# EAGLE schematic moire_v2.7 (EAGLE 9.1.1)

## Sheet 1 of 2
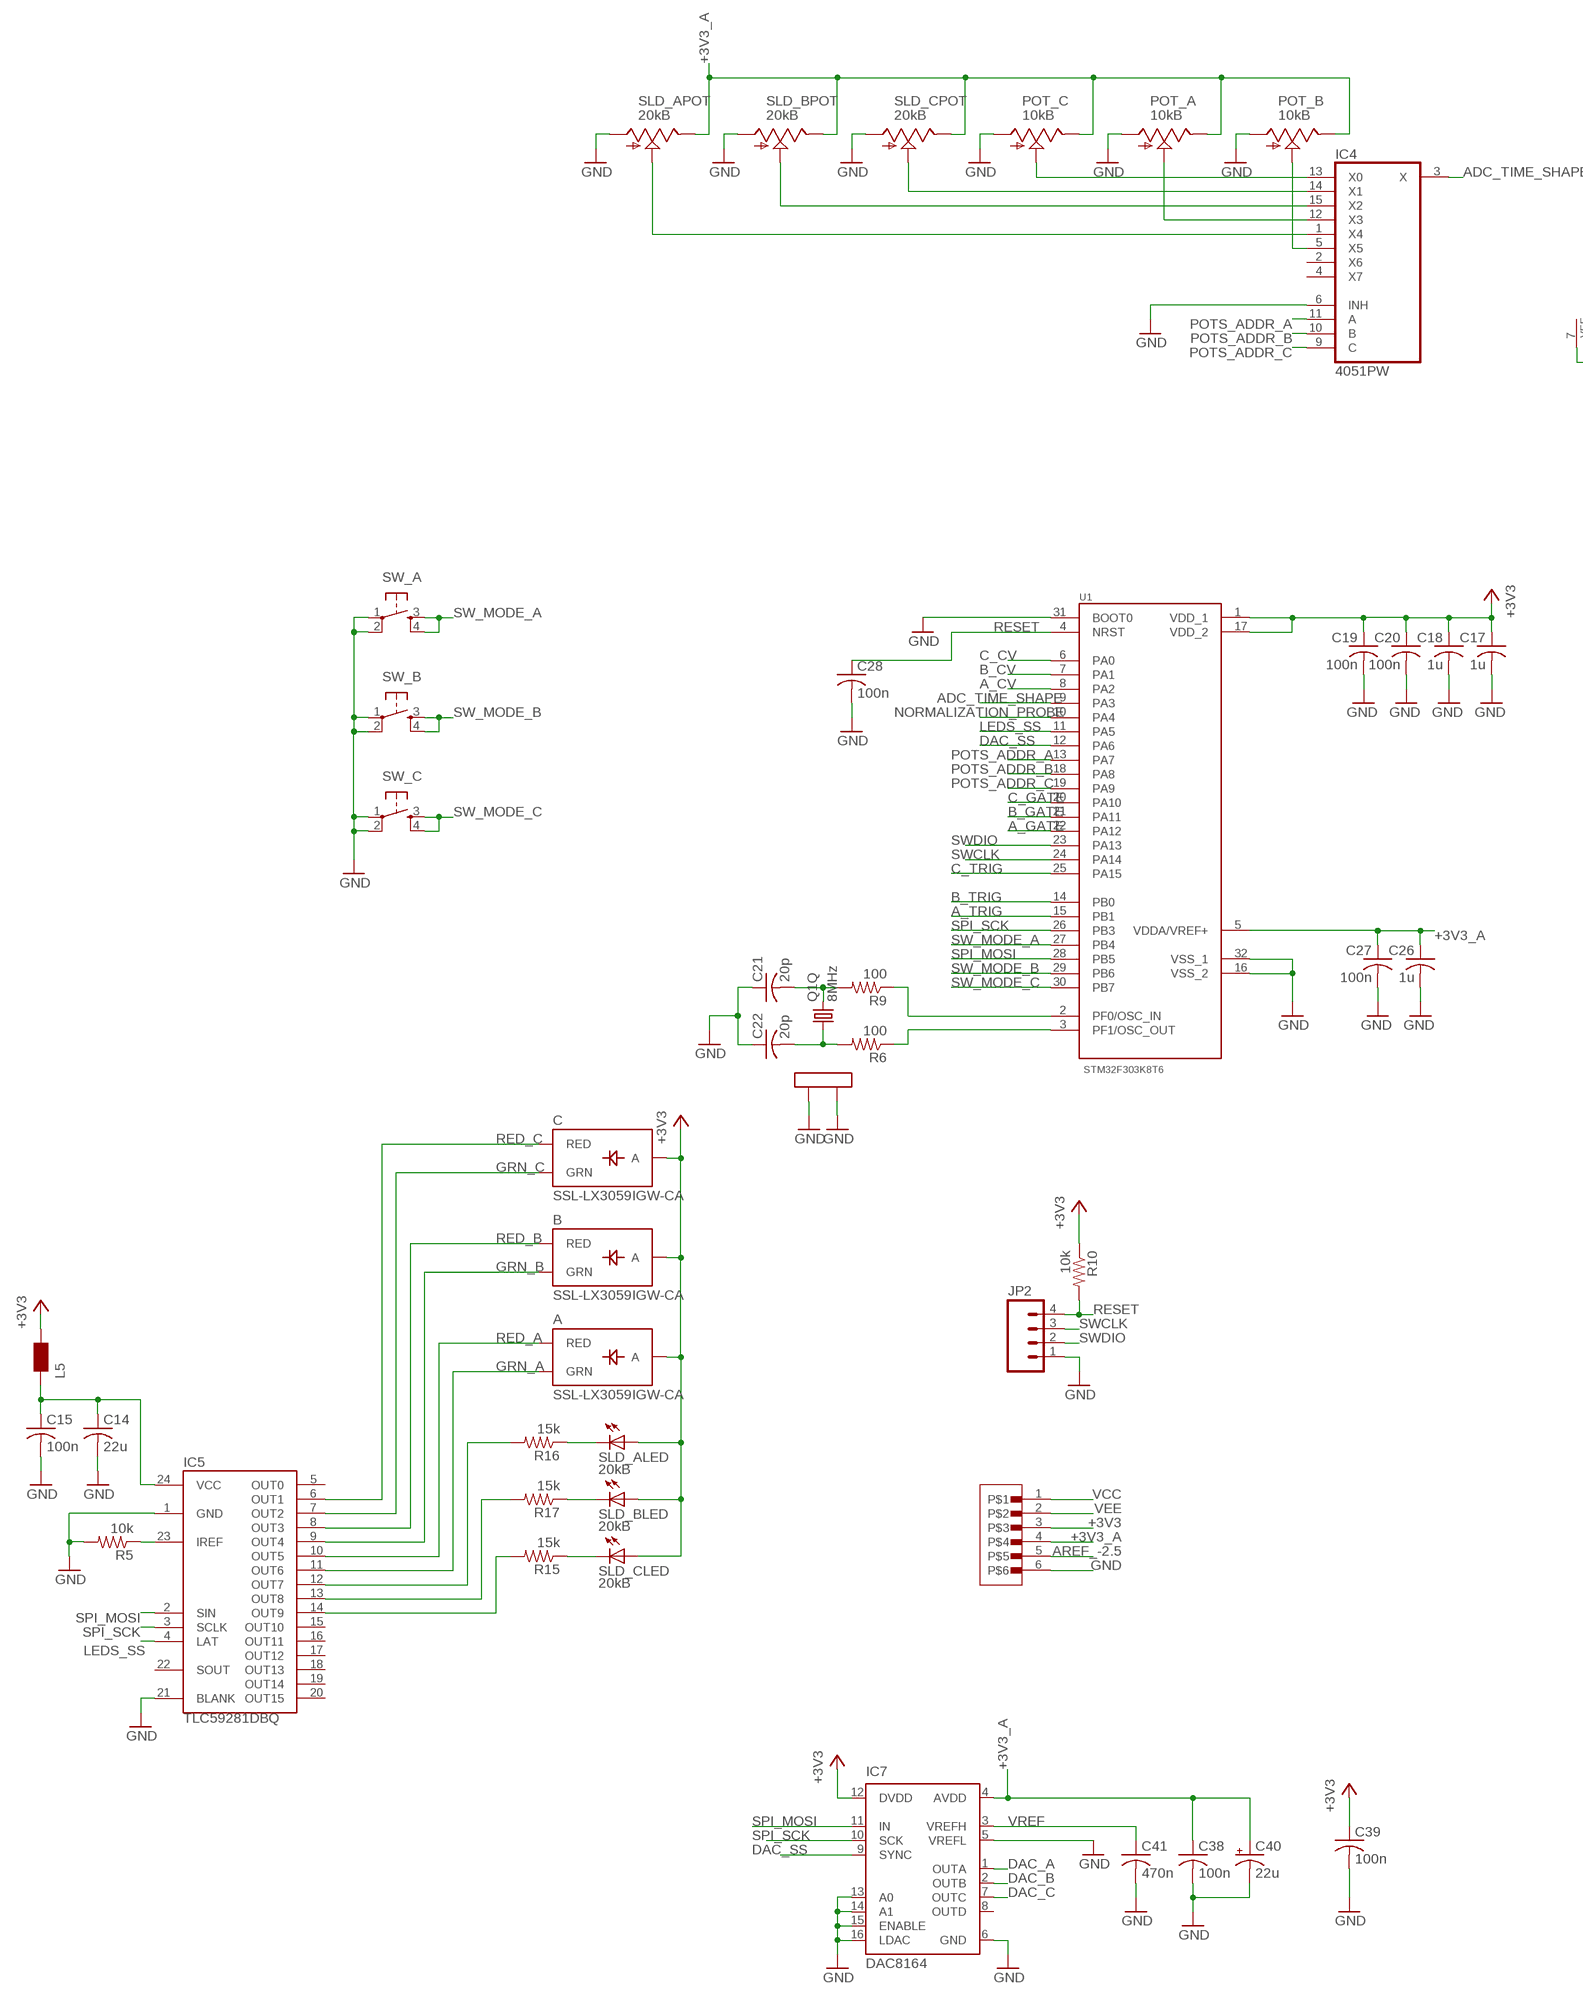
[diagram p0: schematic, sheet 1, part 1 of 2]
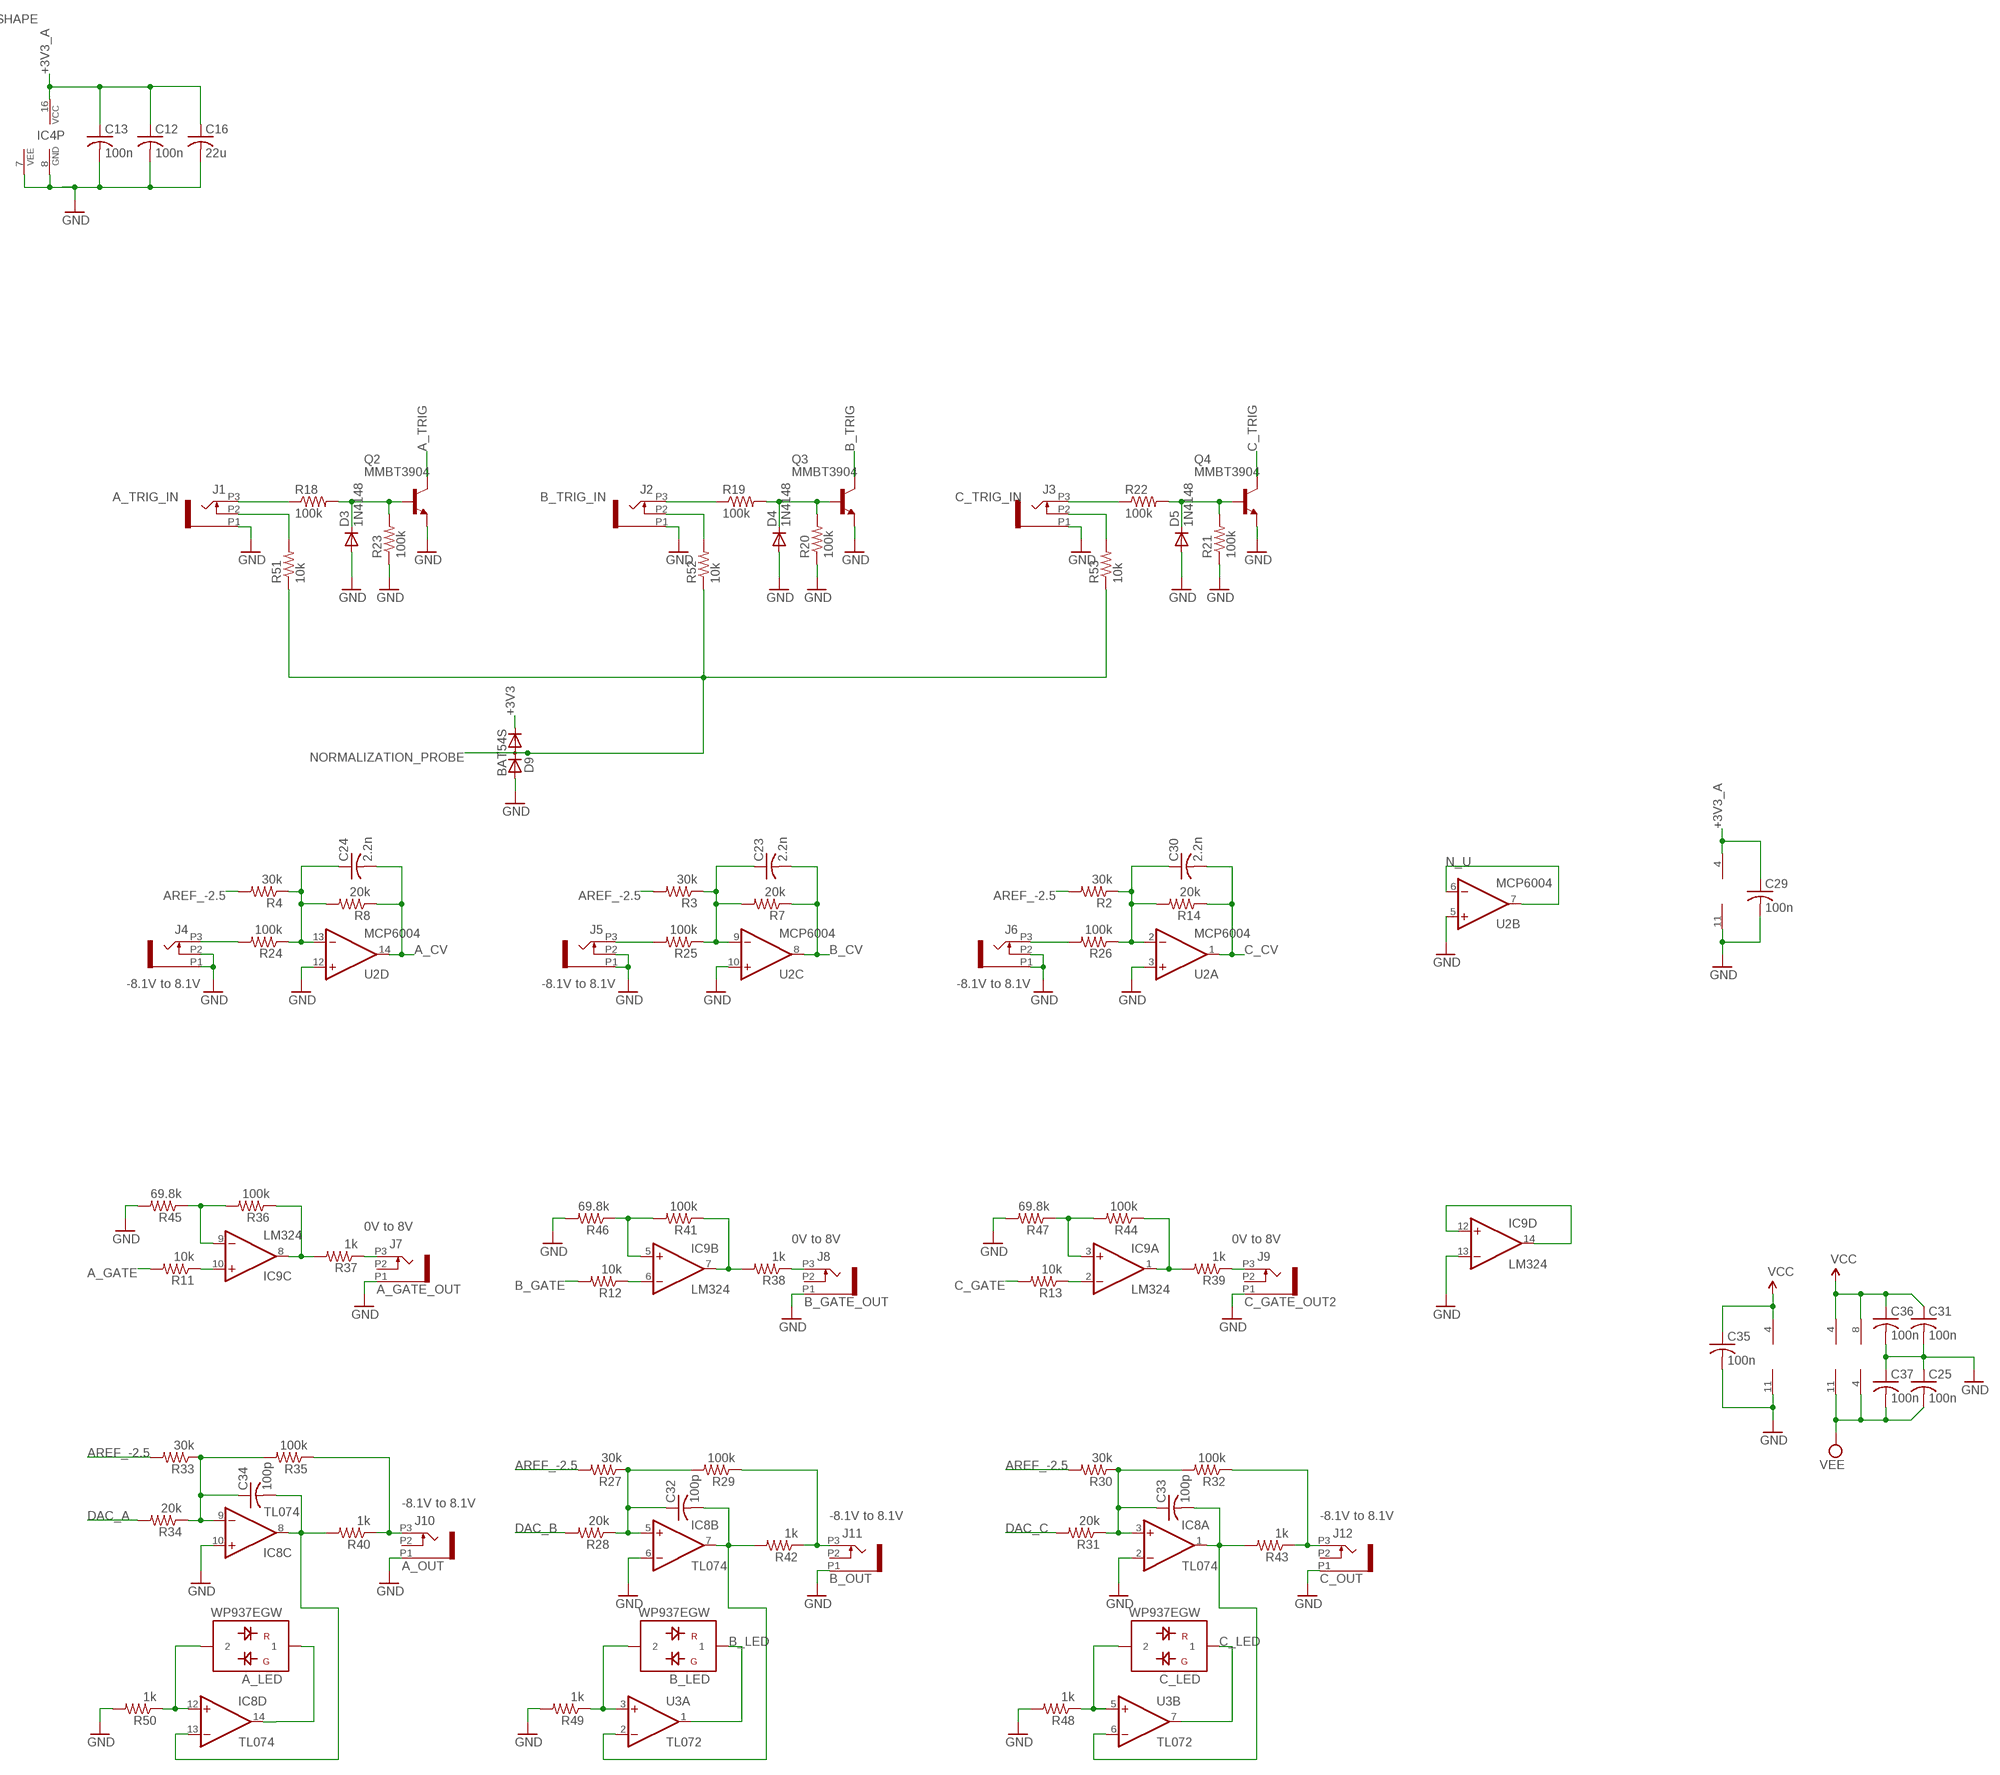
[diagram p1: schematic, sheet 1, part 2 of 2]

### Parts
A  SSL-LX3059IGW-CA  LED-BICOLOR-THROUGHHOLE-CA  [LED-BICOLOR-THROUGHHOLE-LUMEX]
A_LED  WP937EGW  LED-BICOLOR-SHARED-THROUGHHOLE  [LED3MM]
B  SSL-LX3059IGW-CA  LED-BICOLOR-THROUGHHOLE-CA  [LED-BICOLOR-THROUGHHOLE-LUMEX]
B_LED  WP937EGW  LED-BICOLOR-SHARED-THROUGHHOLE  [LED3MM]
C  SSL-LX3059IGW-CA  LED-BICOLOR-THROUGHHOLE-CA  [LED-BICOLOR-THROUGHHOLE-LUMEX]
C12  100n  RCL_C-USC0603  [RCL_C0603]
C13  100n  RCL_C-USC0603  [RCL_C0603]
C14  22u  RCL_C-USC1206  [RCL_C1206]
C15  100n  RCL_C-USC0603  [RCL_C0603]
C16  22u  RCL_C-USC1206  [RCL_C1206]
C17  1u  RCL_C-USC0603  [RCL_C0603]
C18  1u  RCL_C-USC0603  [RCL_C0603]
C19  100n  RCL_C-USC0603  [RCL_C0603]
C20  100n  RCL_C-USC0603  [RCL_C0603]
C21  20p  RCL_C-USC0603  [RCL_C0603]
C22  20p  RCL_C-USC0603  [RCL_C0603]
C23  2.2n  RCL_C-USC0603  [RCL_C0603]
C24  2.2n  RCL_C-USC0603  [RCL_C0603]
C25  100n  RCL_C-USC0603  [RCL_C0603]
C26  1u  RCL_C-USC0603  [RCL_C0603]
C27  100n  RCL_C-USC0603  [RCL_C0603]
C28  100n  RCL_C-USC0603  [RCL_C0603]
C29  100n  RCL_C-USC0603  [RCL_C0603]
C30  2.2n  RCL_C-USC0603  [RCL_C0603]
C31  100n  RCL_C-USC0603  [RCL_C0603]
C32  100p  RCL_C-USC0603  [RCL_C0603]
C33  100p  RCL_C-USC0603  [RCL_C0603]
C34  100p  RCL_C-USC0603  [RCL_C0603]
C35  100n  RCL_C-USC0603  [RCL_C0603]
C36  100n  RCL_C-USC0603  [RCL_C0603]
C37  100n  RCL_C-USC0603  [RCL_C0603]
C38  100n  C-USC0603  [C0603]
C39  100n  C-USC0603  [C0603]
C40  22u  CPOL-USC  [PANASONIC_C]
C41  470n  C-USC0603  [C0603]
C_LED  WP937EGW  LED-BICOLOR-SHARED-THROUGHHOLE  [LED3MM]
D3  1N4148  DIODE_DIODE-SOD323-R  [DIODE_SOD323-R]
D4  1N4148  DIODE_DIODE-SOD323-R  [DIODE_SOD323-R]
D5  1N4148  DIODE_DIODE-SOD323-R  [DIODE_SOD323-R]
D9  BAT54S  DIODE_2CACA-SOT23  [SOT23]
IC4  4051PW  [TSSOP16_065]
IC5  TLC59281DBQ  [TSSOP24_0635]
IC7  DAC8164  DAC8564  [SOP65P640X110-16N]
IC8  TL074  TL074PW  [TSSOP14_065]
IC9  LM324  TL074PW  [TSSOP14_065]
J1  PJ301_THONKICONN6  [WQP_PJ_301M6]
J2  PJ301_THONKICONN6  [WQP_PJ_301M6]
J3  PJ301_THONKICONN6  [WQP_PJ_301M6]
J4  PJ301_THONKICONN6  [WQP_PJ_301M6]
J5  PJ301_THONKICONN6  [WQP_PJ_301M6]
J6  PJ301_THONKICONN6  [WQP_PJ_301M6]
J7  PJ301_THONKICONN6  [WQP_PJ_301M6]
J8  PJ301_THONKICONN6  [WQP_PJ_301M6]
J9  PJ301_THONKICONN6  [WQP_PJ_301M6]
J10  PJ301_THONKICONN6  [WQP_PJ_301M6]
J11  PJ301_THONKICONN6  [WQP_PJ_301M6]
J12  PJ301_THONKICONN6  [WQP_PJ_301M6]
JP2  M04PTH  [1X04]
L5  WE-CBF_0603  [0603]
POT_A  10kB  POT_USVERTICAL  [ALPS_POT_VERTICAL]
POT_B  10kB  POT_USVERTICAL  [ALPS_POT_VERTICAL]
POT_C  10kB  POT_USVERTICAL  [ALPS_POT_VERTICAL]
Q1  8MHz  CRYSTAL  [CTS406]
Q2  MMBT3904  MMBT3904LT1-NPN-SOT23-BEC  [SOT23-BEC]
Q3  MMBT3904  MMBT3904LT1-NPN-SOT23-BEC  [SOT23-BEC]
Q4  MMBT3904  MMBT3904LT1-NPN-SOT23-BEC  [SOT23-BEC]
R2  30k  RCL_R-US_R0603  [RCL_R0603]
R3  30k  RCL_R-US_R0603  [RCL_R0603]
R4  30k  RCL_R-US_R0603  [RCL_R0603]
R5  10k  RCL_R-US_R0603  [RCL_R0603]
R6  100  RCL_R-US_R0603  [RCL_R0603]
R7  20k  RCL_R-US_R0603  [RCL_R0603]
R8  20k  RCL_R-US_R0603  [RCL_R0603]
R9  100  RCL_R-US_R0603  [RCL_R0603]
R10  10k  RCL_R-US_R0603  [RCL_R0603]
R11  10k  RCL_R-US_R0603  [RCL_R0603]
R12  10k  RCL_R-US_R0603  [RCL_R0603]
R13  10k  RCL_R-US_R0603  [RCL_R0603]
R14  20k  RCL_R-US_R0603  [RCL_R0603]
R15  15k  RCL_R-US_R0603  [RCL_R0603]
R16  15k  RCL_R-US_R0603  [RCL_R0603]
R17  15k  RCL_R-US_R0603  [RCL_R0603]
R18  100k  RCL_R-US_R0603  [RCL_R0603]
R19  100k  RCL_R-US_R0603  [RCL_R0603]
R20  100k  RCL_R-US_R0603  [RCL_R0603]
R21  100k  RCL_R-US_R0603  [RCL_R0603]
R22  100k  RCL_R-US_R0603  [RCL_R0603]
R23  100k  RCL_R-US_R0603  [RCL_R0603]
R24  100k  RCL_R-US_R0603  [RCL_R0603]
R25  100k  RCL_R-US_R0603  [RCL_R0603]
R26  100k  RCL_R-US_R0603  [RCL_R0603]
R27  30k  RCL_R-US_R0603  [RCL_R0603]
R28  20k  RCL_R-US_R0603  [RCL_R0603]
R29  100k  RCL_R-US_R0603  [RCL_R0603]
R30  30k  RCL_R-US_R0603  [RCL_R0603]
R31  20k  RCL_R-US_R0603  [RCL_R0603]
R32  100k  RCL_R-US_R0603  [RCL_R0603]
R33  30k  RCL_R-US_R0603  [RCL_R0603]
R34  20k  RCL_R-US_R0603  [RCL_R0603]
R35  100k  RCL_R-US_R0603  [RCL_R0603]
R36  100k  RCL_R-US_R0603  [RCL_R0603]
R37  1k  RCL_R-US_R0603  [RCL_R0603]
R38  1k  RCL_R-US_R0603  [RCL_R0603]
R39  1k  RCL_R-US_R0603  [RCL_R0603]
R40  1k  RCL_R-US_R0603  [RCL_R0603]
R41  100k  RCL_R-US_R0603  [RCL_R0603]
R42  1k  RCL_R-US_R0603  [RCL_R0603]
R43  1k  RCL_R-US_R0603  [RCL_R0603]
R44  100k  RCL_R-US_R0603  [RCL_R0603]
R45  69.8k  RCL_R-US_R0603  [RCL_R0603]
R46  69.8k  RCL_R-US_R0603  [RCL_R0603]
R47  69.8k  RCL_R-US_R0603  [RCL_R0603]
R48  1k  RCL_R-US_R0603  [RCL_R0603]
R49  1k  RCL_R-US_R0603  [RCL_R0603]
R50  1k  RCL_R-US_R0603  [RCL_R0603]
R51  10k  RCL_R-US_R0603  [RCL_R0603]
R52  10k  RCL_R-US_R0603  [RCL_R0603]
R53  10k  RCL_R-US_R0603  [RCL_R0603]
SLD_A  20kB  BOURNS_SLIDER  [BOURNS_SLIDER]
SLD_B  20kB  BOURNS_SLIDER  [BOURNS_SLIDER]
SLD_C  20kB  BOURNS_SLIDER  [BOURNS_SLIDER]
SW_A  TAC_SWITCHPTH  [TACTILE-PTH]
SW_B  TAC_SWITCHPTH  [TACTILE-PTH]
SW_C  TAC_SWITCHPTH  [TACTILE-PTH]
U1  STM32F303K8T6  [QFP80P900X900X160-32N]
U2  MCP6004  MCP6004_SMD  [SO14]
U3  TL072  TL072TSSOP  [TSSOP-8]
U$1  1X6-SMD-TESTPAD  [6X1-SMD-TESTPAD]

### Nets
+3V3 [power]: A.A B.A C17.1 C18.1 C19.1 C20.1 C39.1 C.A D9.2(C) IC7.12(DVDD) L5.2 R10.1 SLD_A.B(LED:A) SLD_B.B(LED:A) SLD_C.B(LED:A) U1.1(VDD_1) U1.17(VDD_2) U$1.3 ; also sheet 2
+3V3_A [power]: C12.1 C13.1 C16.1 C26.1 C27.1 C29.1 C38.1 C40.+ IC4.16(VCC) IC7.4(AVDD) POT_A.P$1(E) POT_B.P$1(E) POT_C.P$1(E) SLD_A.3(POT:E) SLD_B.3(POT:E) SLD_C.3(POT:E) U1.5(VDDA/VREF+) U2.4(P:V+) U$1.4 ; also sheet 2
A_CV: C24.2 R8.1 U1.8(PA2) U2.14(D:OUT)
A_CV_IN: J4.P3 R24.2
A_GATE: R11.2 U1.22(PA12)
A_GATE_OUT: J7.P3 R37.1
A_LED: A_LED.1 IC8.14(D:OUT)
A_OUT: J10.P3 R35.1 R40.1
A_POT: IC4.12(X3) POT_A.P$2(S)
A_SLD: IC4.1(X4) SLD_A.2(POT:S)
A_TRIG: Q2.C U1.15(PB1)
A_TRIG_IN: J1.P3 R18.1
ADC_TIME_SHAPE: IC4.3(X) U1.9(PA3)
AREF_-2.5: R2.2 R3.2 R4.2 R27.2 R30.2 R33.2 U$1.5 ; also sheet 2
B_CV: C23.2 R7.1 U1.7(PA1) U2.8(C:OUT)
B_CV_IN: J5.P3 R25.2
B_GATE: R12.2 U1.21(PA11)
B_GATE_OUT: J8.P3 R38.1
B_LED: B_LED.1 U3.1(A:OUT)
B_OUT: J11.P3 R29.1 R42.1
B_POT: IC4.5(X5) POT_B.P$2(S)
B_SLD: IC4.15(X2) SLD_B.2(POT:S)
B_TRIG: Q3.C U1.14(PB0)
B_TRIG_IN: J2.P3 R19.1
C_CV: C30.2 R14.1 U1.6(PA0) U2.1(A:OUT)
C_CV_IN: J6.P3 R26.2
C_GATE: R13.2 U1.20(PA10)
C_GATE_OUT2: J9.P3 R39.1
C_LED: C_LED.1 U3.7(B:OUT)
C_OUT: J12.P3 R32.1 R43.1
C_POT: IC4.13(X0) POT_C.P$2(S)
C_SLD: IC4.14(X1) SLD_C.2(POT:S)
C_TRIG: Q4.C U1.25(PA15)
C_TRIG_IN: J3.P3 R22.1
DAC_A: IC7.1(OUTA) R34.2
DAC_B: IC7.2(OUTB) R28.2
DAC_C: IC7.7(OUTC) R31.2
DAC_SS: IC7.9(SYNC) U1.12(PA6)
GND: C12.2 C13.2 C14.2 C15.2 C16.2 C17.2 C18.2 C19.2 C20.2 C21.1 C22.1 C25.1 C26.2 C27.2 C28.2 C29.2 C31.2 C35.2 C36.2 C37.1 C38.2 C39.2 C40.- C41.2 D3.A D4.A D5.A D9.1(A) IC4.6(INH) IC4.7(VEE) IC4.8(GND) IC5.1(GND) IC5.21(BLANK) IC7.5(VREFL) IC7.6(GND) IC7.13(A0) IC7.14(A1) IC7.15(ENABLE) IC7.16(LDAC) IC8.2(A:-IN) IC8.6(B:-IN) IC8.10(C:+IN) IC9.11(P:V-) IC9.13(D:-IN) J1.P1 J2.P1 J3.P1 J4.P1 J4.P2 J5.P1 J5.P2 J6.P1 J6.P2 J7.P1 J8.P1 J9.P1 J10.P1 J11.P1 J12.P1 JP2.1 POT_A.P$3(A) POT_B.P$3(A) POT_C.P$3(A) Q1.2(LID1) Q1.4(LID2) Q2.E Q3.E Q4.E R5.2 R20.1 R21.1 R23.1 R45.2 R46.2 R47.2 R48.2 R49.2 R50.2 SLD_A.1(POT:A) SLD_B.1(POT:A) SLD_C.1(POT:A) SW_A.1 SW_A.2 SW_B.1 SW_B.2 SW_C.1 SW_C.2 U1.16(VSS_2) U1.31(BOOT0) U1.32(VSS_1) U2.3(A:+IN) U2.5(B:+IN) U2.10(C:+IN) U2.11(P:V-) U2.12(D:+IN) U$1.6 ; also sheet 2
GRN_A: A.GREEN_C(GRN) IC5.11(OUT6)
GRN_B: B.GREEN_C(GRN) IC5.9(OUT4)
GRN_C: C.GREEN_C(GRN) IC5.7(OUT2)
LEDS_SS: IC5.4(LAT) U1.11(PA5)
N$1: IC5.12(OUT7) R16.2
N$6: IC9.12(D:+IN) IC9.14(D:OUT)
N$8: C32.1 IC8.5(B:+IN) R27.1 R28.1 R29.2
N$9: R9.1 U1.2(PF0/OSC_IN)
N$10: R6.1 U1.3(PF1/OSC_OUT)
N$11: C21.2 Q1.3 R9.2
N$12: C22.2 Q1.1 R6.2
N$13: J1.P2 R51.2
N$14: J2.P2 R52.2
N$15: C32.2 IC8.7(B:OUT) R42.2 U3.2(A:-IN)
N$16: IC9.1(A:OUT) R39.2 R44.1
N$17: J3.P2 R53.2
N$18: C34.1 IC8.9(C:-IN) R33.1 R34.1 R35.2
N$19: C34.2 IC8.8(C:OUT) IC8.13(D:-IN) R40.2
N$24: IC9.3(A:+IN) R44.2 R47.1
N$25: IC9.2(A:-IN) R13.1
N$26: IC9.7(B:OUT) R38.2 R41.1
N$27: R16.1 SLD_A.E(LED:C)
N$28: IC9.5(B:+IN) R41.2 R46.1
N$29: IC9.6(B:-IN) R12.1
N$30: IC9.8(C:OUT) R36.1 R37.2
N$38: IC5.13(OUT8) R17.2
N$39: IC5.14(OUT9) R15.2
N$40: B_LED.2 R49.1 U3.3(A:+IN)
N$41: D3.C Q2.B R18.2 R23.2
N$43: R17.1 SLD_B.E(LED:C)
N$44: C14.1 C15.1 IC5.24(VCC) L5.1
N$45: R15.1 SLD_C.E(LED:C)
N$52: A_LED.2 IC8.12(D:+IN) R50.1
N$57: C30.1 R2.1 R14.2 R26.1 U2.2(A:-IN)
N$58: C23.1 R3.1 R7.2 R25.1 U2.9(C:-IN)
N$59: C24.1 R4.1 R8.2 R24.1 U2.13(D:-IN)
N$61: IC9.9(C:-IN) R36.2 R45.1
N$62: D4.C Q3.B R19.2 R20.2
N$64: IC9.10(C:+IN) R11.1
N$65: D5.C Q4.B R21.2 R22.2
N$68: IC5.23(IREF) R5.1
N$84: C_LED.2 R48.1 U3.5(B:+IN)
N$87: C33.1 IC8.3(A:+IN) R30.1 R31.1 R32.2
N$93: C33.2 IC8.1(A:OUT) R43.2 U3.6(B:-IN)
N_U: U2.6(B:-IN) U2.7(B:OUT)
NORMALIZATION_PROBE: D9.3(AC) R51.1 R52.1 R53.1 U1.10(PA4)
POTS_ADDR_A: IC4.11(A) U1.13(PA7)
POTS_ADDR_B: IC4.10(B) U1.18(PA8)
POTS_ADDR_C: IC4.9(C) U1.19(PA9)
RED_A: A.RED_C(RED) IC5.10(OUT5)
RED_B: B.RED_C(RED) IC5.8(OUT3)
RED_C: C.RED_C(RED) IC5.6(OUT1)
RESET: C28.1 JP2.4 R10.2 U1.4(NRST)
SPI_MOSI: IC5.2(SIN) IC7.11(IN) U1.28(PB5)
SPI_SCK: IC5.3(SCLK) IC7.10(SCK) U1.26(PB3)
SW_MODE_A: SW_A.3 SW_A.4 U1.27(PB4)
SW_MODE_B: SW_B.3 SW_B.4 U1.29(PB6)
SW_MODE_C: SW_C.3 SW_C.4 U1.30(PB7)
SWCLK: JP2.3 U1.24(PA14)
SWDIO: JP2.2 U1.23(PA13)
VCC [power]: C31.1 C35.1 C36.1 IC8.4(P:V+) IC9.4(P:V+) U3.8(P:V+) U$1.1 ; also sheet 2
VEE [power]: C25.2 C37.2 IC8.11(P:V-) U3.4(P:V-) U$1.2 ; also sheet 2
VREF: C41.1 IC7.3(VREFH)
Unconnected: IC4.2(X6) IC4.4(X7) IC5.5(OUT0) IC5.15(OUT10) IC5.16(OUT11) IC5.17(OUT12) IC5.18(OUT13) IC5.19(OUT14) IC5.20(OUT15) IC5.22(SOUT) IC7.8(OUTD) J7.P2 J8.P2 J9.P2 J10.P2 J11.P2 J12.P2

### Notes on the sheet
- -8.1V to 8.1V | -8.1V to 8.1V | -8.1V to 8.1V
- 0V to 8V
- 0V to 8V | 0V to 8V
- -8.1V to 8.1V
- -8.1V to 8.1V | -8.1V to 8.1V

## Sheet 2 of 2
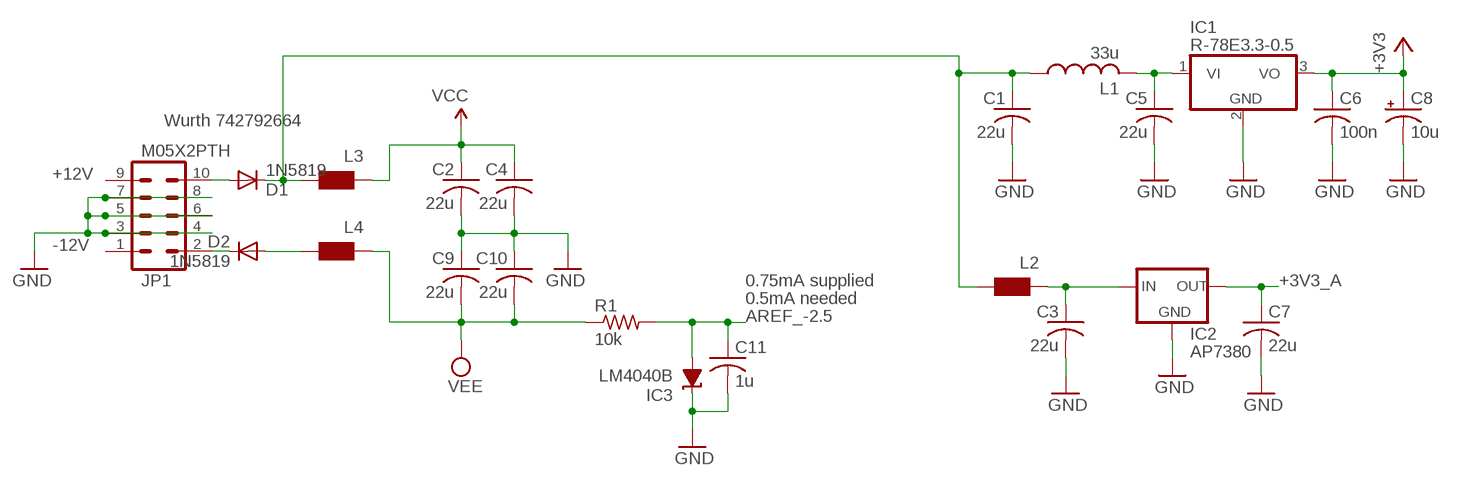
[diagram p2: schematic, sheet 2]

### Parts
C1  22u  RCL_C-USC1206  [RCL_C1206]
C2  22u  RCL_C-USC1206  [RCL_C1206]
C3  22u  RCL_C-USC1206  [RCL_C1206]
C4  22u  RCL_C-USC1206  [RCL_C1206]
C5  22u  RCL_C-USC1206  [RCL_C1206]
C6  100n  RCL_C-USC0603  [RCL_C0603]
C7  22u  RCL_C-USC1206  [RCL_C1206]
C8  10u  RCL_CPOL-USA  [RCL_PANASONIC_A]
C9  22u  RCL_C-USC1206  [RCL_C1206]
C10  22u  RCL_C-USC1206  [RCL_C1206]
C11  1u  RCL_C-USC0603  [RCL_C0603]
D1  1N5819  DIODE_DIODE-SOD123  [DIODE_SOD123]
D2  1N5819  DIODE_DIODE-SOD123  [DIODE_SOD123]
IC1  R-78E3.3-0.5  WE173950378  [WE78]
IC2  AP7380  [SOT89]
IC3  LM4040B  LM4041B12DBZ  [DBZ_R-PDSO-G3]
JP1  M05X2PTH  [2X5-PTH]
L1  33u  L-USL2012C  [L2012C]
L2  WE-CBF_0603  [0603]
L3  WE-CBF_0603  [0603]
L4  WE-CBF_0603  [0603]
R1  10k  RCL_R-US_R0603  [RCL_R0603]

### Nets
+3V3 [power]: C6.1 C8.+ IC1.3(VO) ; also sheet 1
+3V3_A [power]: C7.1 IC2.3(OUT) ; also sheet 1
+12V [power]: D1.A JP1.9 JP1.10
-12V [power]: D2.C JP1.1 JP1.2
AREF_-2.5: C11.1 IC3.2(A) R1.2 ; also sheet 1
GND: C1.2 C2.2 C3.2 C4.2 C5.2 C6.2 C7.2 C8.- C9.1 C10.1 C11.2 IC1.2(GND) IC2.1(GND) IC3.1(C) JP1.3 JP1.4 JP1.5 JP1.6 JP1.7 JP1.8 ; also sheet 1
N$3: D2.A L4.2
N$4: C1.1 D1.C L1.1 L2.2 L3.2
N$5: C3.1 IC2.2(IN) IC2.4(IN) L2.1
N$66: C5.1 IC1.1(VI) L1.2
VCC [power]: C2.1 C4.1 L3.1 ; also sheet 1
VEE [power]: C9.2 C10.2 L4.1 R1.1 ; also sheet 1

### Notes on the sheet
- Wurth 742792664
- 0.75mA supplied
- 0.5mA needed

## Library data of the parts
A B C = og-leds:LED-BICOLOR-THROUGHHOLE-CA
A_LED B_LED C_LED = og-leds:LED-BICOLOR-SHARED-THROUGHHOLE
C1-C7 C9-C37 = moire_v1.5-routed:RCL_C-US: CAPACITOR, American symbol
C8 = moire_v1.5-routed:RCL_CPOL-US: POLARIZED CAPACITOR, American symbol
C38 C39 C41 = rcl:C-US: CAPACITOR, American symbol
C40 = rcl:CPOL-US: POLARIZED CAPACITOR, American symbol
D1-D5 = moire_v1.7:DIODE_DIODE-: DIODE
D9 = diode:DIODE_2CACA-: 2 Diodes - Cathode-Anode|Cathode-Anode
IC1 = og-vreg:WE173950378
IC2 = v-reg-custom:AP7380
IC3 = texas:LM4041: PRECISION MICROPOWER SHUNT VOLTAGE REFERENCE Source: http://focus.ti.com/lit/ds/slcs146e/slcs146e.pdf
IC4 = og-ics:4051: 8-channel ANALOG MULTIPLEXER
IC5 = og-ics:TLC59281
IC7 = og-dac:DAC8564
IC8 = linear:TL074: OP AMP
IC9 = og-linear:TL074: OP AMP
J1-J12 = og-pj301_variations:PJ301_THONKICONN
JP1 = og-header:M05X2: Header 5x2 Standard 10-pin dual row 0.1" header. Commonly used with AVR-ISP. Use with Spark Fun Electronics SKU: PRT-00778
JP2 = SparkFun:M04: Header 4 Standard 4-pin 0.1" header. Use with straight break away headers (SKU : PRT-00116), right angle break away headers (PRT-00553), swiss pins (PRT-00743), machine pins (PRT-00117), and female headers (PRT-00115). Molex polarized connector foot print use with SKU : PRT-08231 with associated crimp pins and housings.
L1 = og-rcl:L-US
L2-L5 = wuerth-elektronik:WE-CBF: SMD EMI Suppression Ferrite Beads - excellent anti-EMI properties - low DCR - impedances till 3000 ohms - rated current up to 6 A
POT_A POT_B POT_C = og-pots:POT_US
Q1 = og-crystal:CRYSTAL: Crystal with 2 extra terminals for the metal LID (Abracon ABMM2 for example)
Q2-Q4 = transistor:*-NPN-: NPN Transistror BF959 corrected 2008.03.06
R1-R53 = moire_v1.5-routed:RCL_R-US_: RESISTOR, American symbol
SLD_A SLD_B SLD_C = og-pots:BOURNS_SLIDER
SW_A SW_B SW_C = SparkFun:TAC_SWITCH: Momentary Switch Button commonly used for reset or general input. Spark Fun Electronics SKU : COM-00097
U1 = STM32F303K8T6:STM32F303K8T6: Analog and DSP with FPU ARM Cortex-M4 MCU with 64 Kbytes Flash, 72 MHz CPU, CCM, 12-bit ADC 5 MSPS, comparators, op-amp; AVAILABILITY: Unavailable; DESCRIPTION: Analog and DSP with FPU ARM Cortex-M4 MCU with 64 Kbytes Flash, 72 MHz CPU, CCM, 12-bit ADC 5 MSPS, comparators, op-amp; MF: STMicroelectronics; MP: STM32F303K8T6; PACKAGE: LQFP-32 STMicroelectronics; PRICE: None
U2 = MusicThingModular:MCP6004: Generic Quad Op Amp
U3 = MusicThingModular:TL072: Generic Dual Op Amp
U$1 = CUSTOM:1X6-SMD-TESTPAD